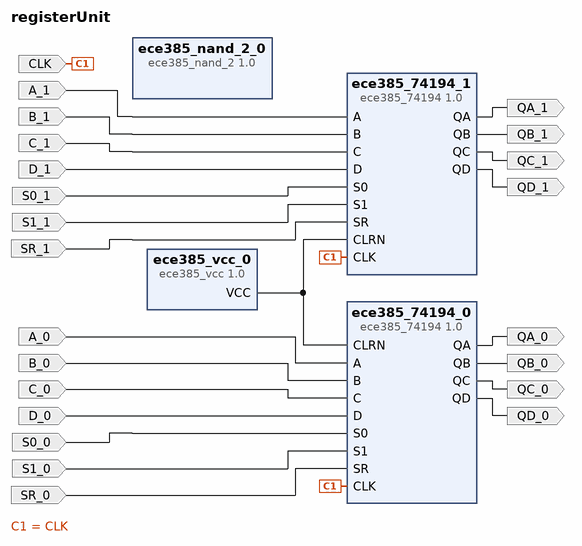
[diagram p0: block diagram of the top level]
# Vivado block design registerUnit, xc7s50csga324-1, Vivado 2022.2
create_bd_design registerUnit

create_bd_port -dir I A_0
create_bd_port -dir I B_0
create_bd_port -dir I C_0
create_bd_port -dir I D_0
create_bd_port -dir O QA_0
create_bd_port -dir O QB_0
create_bd_port -dir O QC_0
create_bd_port -dir O QD_0
create_bd_port -dir I S0_0
create_bd_port -dir I S1_0
create_bd_port -dir I SR_0
create_bd_port -dir I A_1
create_bd_port -dir I B_1
create_bd_port -dir I C_1
create_bd_port -dir I -type clk CLK
create_bd_port -dir I D_1
create_bd_port -dir O QA_1
create_bd_port -dir O QB_1
create_bd_port -dir O QC_1
create_bd_port -dir O QD_1
create_bd_port -dir I S0_1
create_bd_port -dir I S1_1
create_bd_port -dir I SR_1

create_bd_cell -type ip -vlnv ece.illinois.edu:ece385:ece385_74194:1.0 ece385_74194_0
create_bd_cell -type ip -vlnv ece.illinois.edu:ece385:ece385_74194:1.0 ece385_74194_1
create_bd_cell -type ip -vlnv ece.illinois.edu:ece385:ece385_vcc:1.0 ece385_vcc_0
create_bd_cell -type ip -vlnv ece.illinois.edu:ece385:ece385_nand_2:1.0 ece385_nand_2_0

# ---- connections ----

connect_bd_net -net A_0_1 [get_bd_ports A_0] [get_bd_pins ece385_74194_0/A]
connect_bd_net -net A_1_1 [get_bd_ports A_1] [get_bd_pins ece385_74194_1/A]
connect_bd_net -net B_0_1 [get_bd_ports B_0] [get_bd_pins ece385_74194_0/B]
connect_bd_net -net B_1_1 [get_bd_ports B_1] [get_bd_pins ece385_74194_1/B]
connect_bd_net -net CLK_1_1 [get_bd_ports CLK] [get_bd_pins ece385_74194_1/CLK] [get_bd_pins ece385_74194_0/CLK]
connect_bd_net -net CLRN_0_1 [get_bd_pins ece385_vcc_0/VCC] [get_bd_pins ece385_74194_0/CLRN] [get_bd_pins ece385_74194_1/CLRN]
connect_bd_net -net C_0_1 [get_bd_ports C_0] [get_bd_pins ece385_74194_0/C]
connect_bd_net -net C_1_1 [get_bd_ports C_1] [get_bd_pins ece385_74194_1/C]
connect_bd_net -net D_0_1 [get_bd_ports D_0] [get_bd_pins ece385_74194_0/D]
connect_bd_net -net D_1_1 [get_bd_ports D_1] [get_bd_pins ece385_74194_1/D]
connect_bd_net -net S0_0_1 [get_bd_ports S0_0] [get_bd_pins ece385_74194_0/S0]
connect_bd_net -net S0_1_1 [get_bd_ports S0_1] [get_bd_pins ece385_74194_1/S0]
connect_bd_net -net S1_0_1 [get_bd_ports S1_0] [get_bd_pins ece385_74194_0/S1]
connect_bd_net -net S1_1_1 [get_bd_ports S1_1] [get_bd_pins ece385_74194_1/S1]
connect_bd_net -net SR_0_1 [get_bd_ports SR_0] [get_bd_pins ece385_74194_0/SR]
connect_bd_net -net SR_1_1 [get_bd_ports SR_1] [get_bd_pins ece385_74194_1/SR]
connect_bd_net [get_bd_pins ece385_74194_0/QA] [get_bd_ports QA_0]
connect_bd_net [get_bd_pins ece385_74194_0/QB] [get_bd_ports QB_0]
connect_bd_net [get_bd_pins ece385_74194_0/QC] [get_bd_ports QC_0]
connect_bd_net [get_bd_pins ece385_74194_0/QD] [get_bd_ports QD_0]
connect_bd_net [get_bd_pins ece385_74194_1/QA] [get_bd_ports QA_1]
connect_bd_net [get_bd_pins ece385_74194_1/QB] [get_bd_ports QB_1]
connect_bd_net [get_bd_pins ece385_74194_1/QC] [get_bd_ports QC_1]
connect_bd_net [get_bd_pins ece385_74194_1/QD] [get_bd_ports QD_1]

validate_bd_design
save_bd_design
